# Altium schematic sheet display.SchDoc
size B; Address1: MILWAUKEE TOOL; Address2: 13135 W. Lisbon Rd.; Address3: Brookfield, WI 53005; SheetNumber: 1; SheetTotal: 1
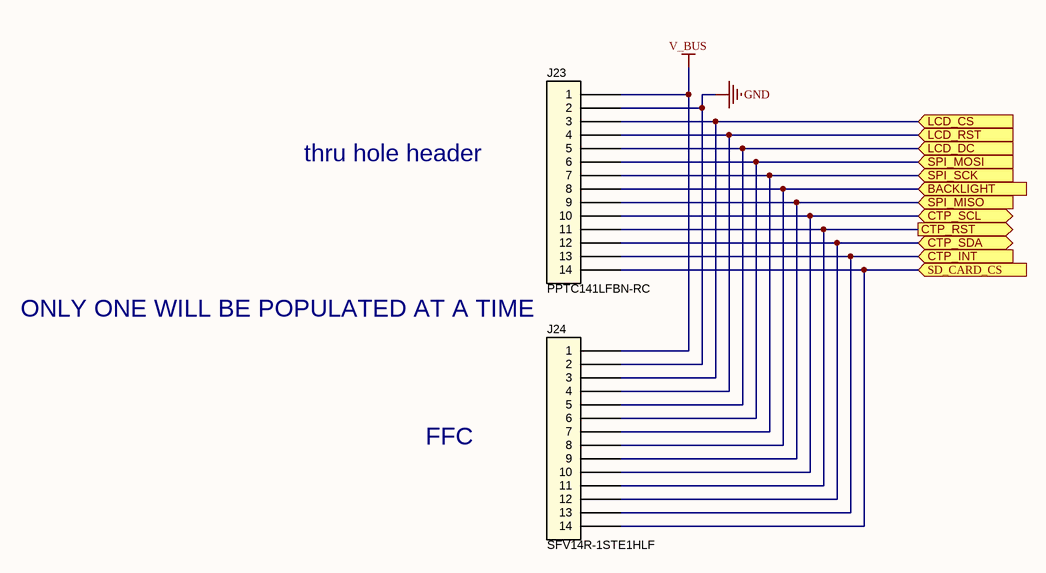
[diagram p0: display.SchDoc]

## Parts
J23  PPTC141LFBN-RC  [CONN_SULLINS_PPTC141LFBN-RC]
J24  SFV14R-1STE1HLF  [CONN_AMPHENOL_SFV14R-1STE1HLF]

## Ports
BACKLIGHT (in), CTP_INT (in), CTP_RST (out), CTP_SCL (bidir), CTP_SDA (bidir), LCD_CS (in), LCD_DC (in), LCD_RST (in), SD_CARD_CS (in), SPI_MISO (in), SPI_MOSI (in), SPI_SCK (in)

## Nets
GND: J23.2 J24.2
V_BUS: J23.1 J24.1
BACKLIGHT: J23.8 J24.8 ; port BACKLIGHT
CTP_INT: J23.13 J24.13 ; port CTP_INT
CTP_RST: J23.11 J24.11 ; port CTP_RST
CTP_SCL: J23.10 J24.10 ; port CTP_SCL
CTP_SDA: J23.12 J24.12 ; port CTP_SDA
LCD_CS: J23.3 J24.3 ; port LCD_CS
LCD_DC: J23.5 J24.5 ; port LCD_DC
LCD_RST: J23.4 J24.4 ; port LCD_RST
SD_CARD_CS: J23.14 J24.14 ; port SD_CARD_CS
SPI_MISO: J23.9 J24.9 ; port SPI_MISO
SPI_MOSI: J23.6 J24.6 ; port SPI_MOSI
SPI_SCK: J23.7 J24.7 ; port SPI_SCK

## Notes on the sheet
- thru hole header
- ONLY ONE WILL BE POPULATED AT A TIME
- FFC
- Schematic Notes
- Schematic Revision History
- Title
- ALL CAPACITORS ARE CERAMIC, 0603, 50V, 10%, X7R UNLESS OTHERWISE STATED
- ALL RESISTORS ARE FILM, 0603, 1/10W, 5%, 200ppm/°C UNLESS OTHERWISE STATED
- Size:
- Date:
- B
- Number:
- Sheet
- Revision:
- of
- Drawn By:
- Brookfield, WI 53005
- File:
- Platform Base:
- Engineer:
- This Document is the property of MILWAUKEE TOOL and may not be reproduced, in any form, without the written premission of MILWAUKEE TOOL.

## Library data of the parts
J23 = CMP-007-0083: CONN HEADER RECEPTACLE VERT 14POS 2.54MM GOLD; MFR: Sullins Connector Solutions; Voltage Rating: 250V AC(RMS)/DC; Durability: 50 mating cycles; Current Rating: 1A; System: Connector; Temp Range: -40 / +105 C; Gender: Male; Value: PPTC141LFBN-RC; Orientation: Verticle; Terminal Pitch: 2.54mm; RoHS Compliant: Yes; Design Item ID: CON/14P/2.54mm/1A/PPTC141LFBN-RC/SULLINS; MFR#: PPTC141LFBN-RC; Contact Finish: Tin; ComponentLink1Description: Drawing; ComponentLink1URL: https://mm.digikey.com/Volume0/opasdata/d220001/medias/docus/937/Female_Headers.100_DS.pdf
J24 = CMP-007-0082: CONN FFC BOTTOM 14POS 0.5MM R/A; MFR: Amphenol ICC (FCI); Voltage Rating: 250V AC(RMS)/DC; Durability: 50 mating cycles; Current Rating: 0.5A; System: Connector; Temp Range: -55 / +105 C; Gender: Male; Value: SFV14R-1STE1HLF; Orientation: Right Angle; Terminal Pitch: 0.5mm; RoHS Compliant: Yes; Design Item ID: CON/14P/0.5mm/0.5A/SFV14R-1STBE1HLF/Amphenol; MFR#: SFV14R-1STE1HLF; Contact Finish: Gold; ComponentLink1Description: Drawing; ComponentLink1URL: https://cdn.amphenol-cs.com/media/wysiwyg/files/documentation/datasheet/flex/flexconnectors_050mm_sfvr.pdf